# Altium schematic sheet TCRME lab3.SchDoc
size A4; SheetNumber: 1; SheetTotal: 1
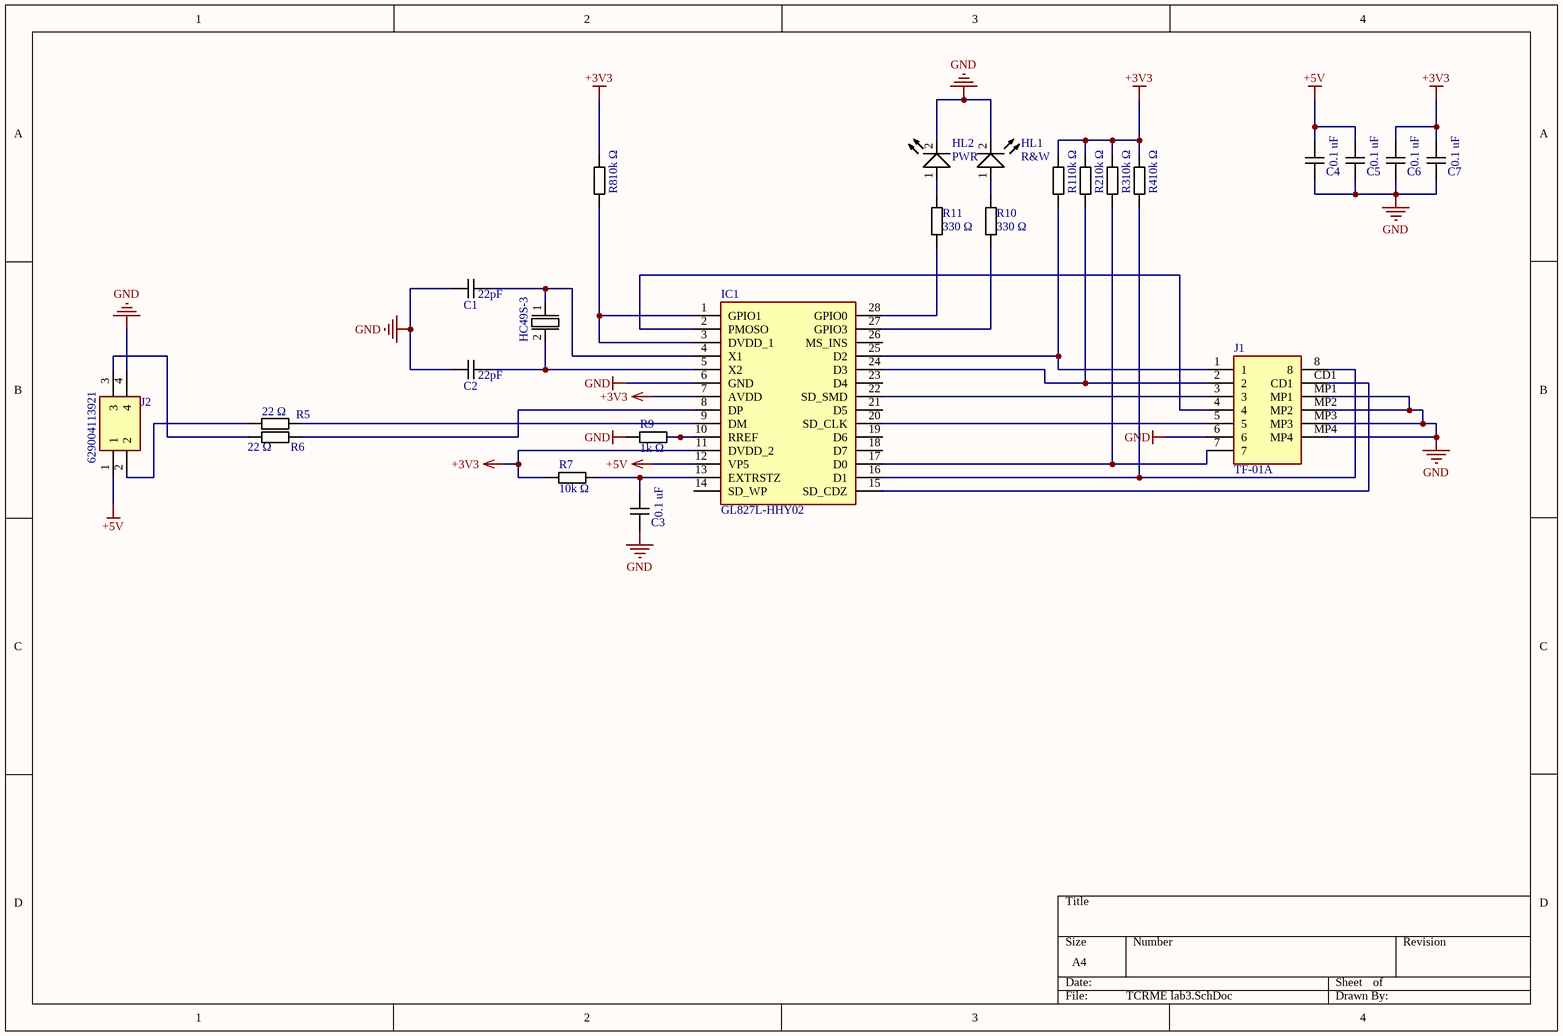
[diagram p0: TCRME lab3.SchDoc]

## Parts
C1  22pF  [1206]
C2  22pF  [1206]
C3  0.1 uF  [1206]
C4  0.1 uF  [1206]
C5  0.1 uF  [1206]
C6  0.1 uF  [1206]
C7  0.1 uF  [1206]
HL1  R&W  [LED_3MM_GREEN]
HL2  PWR  [LED_3MM_GREEN]
IC1  GL827L-HHY02  [SOP64P600X175-28N]
J1  TF-01A  [TF01A]
J2  629004113921  [629004113921]
R1  10k Ω  [RESC1608(0603)N]
R2  10k Ω  [RESC1608(0603)N]
R3  10k Ω  [RESC1608(0603)N]
R4  10k Ω  [RESC1608(0603)N]
R5  22 Ω  [RESC1608(0603)N]
R6  22 Ω  [RESC1608(0603)N]
R7  10k Ω  [RESC1608(0603)N]
R8  10k Ω  [RESC1608(0603)N]
R9  1k Ω  [RESC1608(0603)N]
R10  330 Ω  [RESC1608(0603)N]
R11  330 Ω  [RESC1608(0603)N]
Y1  HC49S-3  [HC49S-3]

## Nets
+3V3: C6.2 C7.2 IC1.7(AVDD) IC1.11(DVDD_2) R1.2 R2.2 R3.2 R4.2 R7.2 R8.2
+5V: C4.2 C5.2 IC1.12(VP5) J2.1
GND: C1.1 C2.1 C3.1 C4.1 C5.1 C6.1 C7.1 HL1.2(K) HL2.2(K) IC1.6(GND) J1.6 J1.MP1 J1.MP2 J1.MP3 J1.MP4 J2.4 R9.2
NetC1_2: C1.2 IC1.4(X1) Y1.1
NetC2_2: C2.2 IC1.5(X2) Y1.2
NetC3_2: C3.2 IC1.13(EXTRSTZ) R7.1
NetHL1_1: HL1.1(A) R10.1
NetHL2_1: HL2.1(A) R11.1
NetIC1_1: IC1.1(GPIO1) IC1.3(DVDD_1) R8.1
NetIC1_2: IC1.2(PMOSO) J1.4
NetIC1_8: IC1.8(DP) R6.1
NetIC1_9: IC1.9(DM) R5.2
NetIC1_10: IC1.10(RREF) R9.1
NetIC1_15: IC1.15(SD_CDZ) J1.CD1
NetIC1_16: IC1.16(D1) J1.8 R4.1
NetIC1_17: IC1.17(D0) J1.7 R3.1
NetIC1_20: IC1.20(SD_CLK) J1.5
NetIC1_22: IC1.22(SD_SMD) J1.3
NetIC1_24: IC1.24(D3) J1.2 R2.1
NetIC1_25: IC1.25(D2) J1.1 R1.1
NetIC1_27: IC1.27(GPIO3) R10.2
NetIC1_28: IC1.28(GPIO0) R11.2
NetJ2_2: J2.2 R5.1
NetJ2_3: J2.3 R6.2

Not connected (* = marked no-connect by the designer): IC1 14(SD_WP) 18(D7) 19(D6) 21(D5) 23(D4) 26(MS_INS)

## Library data of the parts
C1-C7 = 1206B221M251CT: Cap Cer MLCC SMD 220pF 250V X7R 20% 1206; Note: Backorder; Part Number: 1206B221M251CT; HelpURL: https://eu.mouser.com/ProductDetail/Walsin/1206B221M251CT?qs=ZrPdAQfJ6DONB%2FPOr%252Bgk%2Fg%3D%3D; Manufacturer Part Number: 1206B221M251CT; Package: 1206; Mouser Part Number: 791-1206B221M251CT
HL1 HL2 = FYL-5013 GD: Part Number: FYL-5013 GD
IC1 = GL827L-HHY02: Integrated Circuit; Manufacturer_Name: Genesys Logic; Datasheet Link: https://datasheet.lcsc.com/szlcsc/Genesys-Logic-GL827L-HHY02_C161839.pdf; Height: 1.75mm; Manufacturer_Part_Number: GL827L-HHY02
J1 = TF-01A: Connector; Manufacturer_Name: Korean Hroparts Elec; Description: Connector - Card Sockets 8 1.1mm SMD RoHS; Datasheet Link: https://datasheet.lcsc.com/szlcsc/1903221101_Korean-Hroparts-Elec-TF-01A_C91145.pdf; Height: 1.85mm; Manufacturer_Part_Number: TF-01A
J2 = 629004113921: Connector; Manufacturer_Name: Wurth Elektronik; Datasheet Link: http://katalog.we-online.de/em/datasheet/629004113921.pdf; Manufacturer_Part_Number: 629004113921; Mouser Part Number: 710-629004113921; Mouser Price/Stock: https://www.mouser.co.uk/ProductDetail/Wurth-Elektronik/629004113921?qs=35zkduByVmhHRkVkRjAlEQ%3D%3D
R1-R11 = CPF0603F137KC1: RES SMD 0603 137k 1% 50ppm; Part Number: CPF0603F137KC1; HelpURL: https://eu.mouser.com/ProductDetail/TE-Connectivity-Holsworthy/CPF0603F137KC1?qs=%2Fha2pyFadujSa3OD4DCoYOqNfY8rbrxkv%2FEBUVUJ1iFL1vG%2FD14mug%3D%3D; Price$: 0.022; Manufacturer Part Number: CPF0603F137KC1; Package: 0603; Mouser Part Number: 279-CPF0603F137KC1
Y1 = HC49S-3: Part Number: HC49S-3